# Altium project Mach Master.PrjPCB
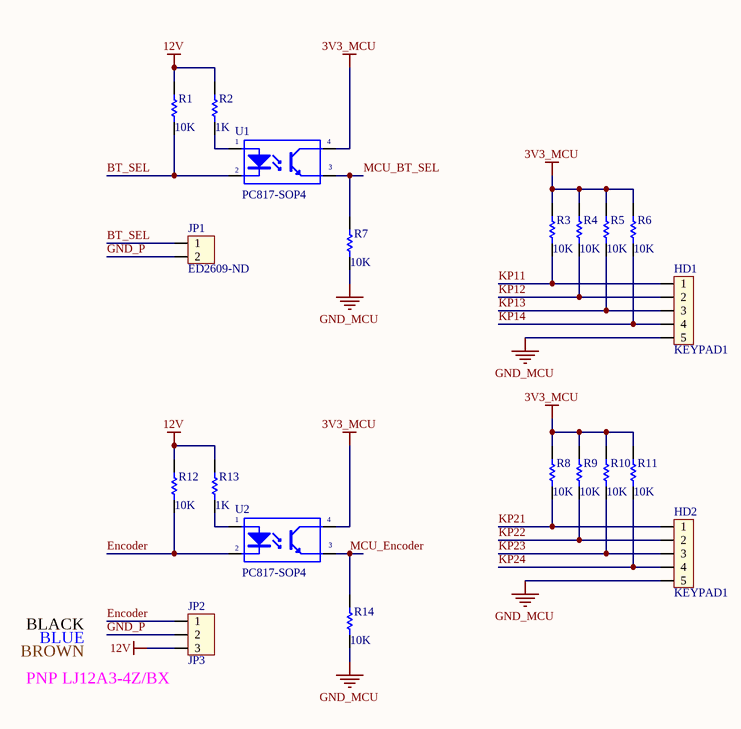
[diagram p0: Input.SchDoc]
5 sheets, 129 parts. Net scope: global (net labels, ports and power ports of the same name join across sheets).
Board file: Master.PcbDoc
Sheets:
  Input.SchDoc
  MCU.SchDoc
  Output.SchDoc
  Power.SchDoc
  RS485.SchDoc

## Sheet Input.SchDoc: INPUT
size A4

### Parts
HD1  KEYPAD1  [CON5]
HD2  KEYPAD1  [CON5]
JP1  ED2609-ND  [2EDGR-5.08-02P]
JP2  JP3  [2EDGR-5.08-03P]
R1  10K  [Res 0805 SMD]
R2  1K  [Res 0805 SMD]
R3  10K  [Res 0805 SMD]
R4  10K  [Res 0805 SMD]
R5  10K  [Res 0805 SMD]
R6  10K  [Res 0805 SMD]
R7  10K  [Res 0805 SMD]
R8  10K  [Res 0805 SMD]
R9  10K  [Res 0805 SMD]
R10  10K  [Res 0805 SMD]
R11  10K  [Res 0805 SMD]
R12  10K  [Res 0805 SMD]
R13  1K  [Res 0805 SMD]
R14  10K  [Res 0805 SMD]
U1  PC817-SOP4  [TPC817-4SOP]
U2  PC817-SOP4  [TPC817-4SOP]

### Nets
3V3_MCU: R3.2 R4.2 R5.2 R6.2 R8.2 R9.2 R10.2 R11.2 U1.4(C) U2.4(C)
12V: JP2.3 R1.2 R2.2 R12.2 R13.2
GND_MCU: HD1.5 HD2.5 R7.1 R14.1
GND_P: JP1.2 JP2.2
BT_SEL: JP1.1 R1.1 U1.2(K)
Encoder: JP2.1 R12.1 U2.2(K)
KP11: HD1.1 R3.1
KP12: HD1.2 R4.1
KP13: HD1.3 R5.1
KP14: HD1.4 R6.1
KP21: HD2.1 R8.1
KP22: HD2.2 R9.1
KP23: HD2.3 R10.1
KP24: HD2.4 R11.1
MCU_BT_SEL: R7.2 U1.3(E)
MCU_Encoder: R14.2 U2.3(E)
NetR2_1: R2.1 U1.1(A)
NetR13_1: R13.1 U2.1(A)

### Notes on the sheet
- BLACK
- BROWN
- (near JP2) PNP LJ12A3-4Z/BX
- BLUE
- Title
- Size:
- Date:
- A4
- Number:
- Time:
- Revision:
- Sheet
- of
- File:

### Library data of the parts
HD1 HD2 = Header5: Header 5; Creat by: VanDungEvn@Gmail.com
JP1 = Con2: 2 Position Wire to Board Terminal Block Horizontal with Board 0.200" (5.08mm) Through Hole; Value: Connector 2; Digikey: ED2609-ND
JP2 = Con3: Connector 3; Value: Connector 3
R1 R12 = 10K/R0603/1%: RES SMD 10K OHM 1% 1/10W 0603; Manufacturer: Yageo; Manufacturer Part Number: RC0603FR-0710KL; Power (Watts): 0.1W, 1/10W; Temperature Coefficient: ±100ppm/°C; Supplier 1: Digi-Key; RoHS: RoHS Compliant; Category: Resistors; Stock 1: 11440000; Pricing 1: 5000=0.00167, 10000=0.00145, 25000=0.00128, 50000=0.00117, 125000=0.00115 (USD); Packaging: Tape & Reel (TR); Resistance (Ohms): 10k; Tolerance: ±1%; Composition: Thick Film; Features: Moisture Resistant; Operating Temperature: -55°C ~ 155°C; Package / Case: 0603 (1608 Metric); Supplier Device Package: 0603; Size / Dimension: 0.063" L x 0.031" W (1.60mm x 0.80mm); Height: 0.022" (0.55mm); Number of Terminations: 2; ComponentLink1URL: http://www.yageo.com/NewPortal/yageodocoutput?fileName=/pdf/R-Chip/PYu-RC_Group_51_RoHS_L_3.pdf; ComponentLink1Description: http://www.yageo.com/NewPortal/yageodocoutput?fileName=/pdf/R-Chip/PYu-RC_Group_51_RoHS_L_3.pdf; Supplier Part Number 1: 311-10.0KHRTR-ND; Buy Link: https://www.thegioiic.com/products?utf8=%E2%9C%93&search=%C4%91i%E1%BB%87n+tr%E1%BB%9F+0805
R2 R13 = 10K/R0603/1%: 1 kOhms ±1% 0.125W, 1/8W Chip Resistor 0805 (2012 Metric) Automotive AEC-Q200 Thick Film; Resistance (Ohms): 10k; Power (Watts): 0.1W, 1/10W; RoHS: RoHS Compliant; Category: Resistors; Features: Moisture Resistant; Operating Temperature: -55°C ~ 155°C; Package / Case: 0603 (1608 Metric); Supplier Device Package: 0603; Size / Dimension: 0.063" L x 0.031" W (1.60mm x 0.80mm); Height: 0.022" (0.55mm); Number of Terminations: 2; ComponentLink1URL: http://www.yageo.com/NewPortal/yageodocoutput?fileName=/pdf/R-Chip/PYu-RC_Group_51_RoHS_L_3.pdf; ComponentLink1Description: http://www.yageo.com/NewPortal/yageodocoutput?fileName=/pdf/R-Chip/PYu-RC_Group_51_RoHS_L_3.pdf; Digikey: 541-1.00KCCT-ND; Buy Link: https://www.thegioiic.com/products?utf8=%E2%9C%93&search=%C4%91i%E1%BB%87n+tr%E1%BB%9F+0805
R3-R11 R14 = 249K/R0805/1%: RES SMD 249K OHM 1% 1/10W 0805; Manufacturer: Yageo; Manufacturer Part Number: RC0603FR-07249KL; Power (Watts): 0.1W, 1/10W; Temperature Coefficient: ±100ppm/°C; Supplier 1: Digi-Key; RoHS: RoHS Compliant; Category: Resistors; Stock 1: 370515; Pricing 1: 1=0.1, 10=0.015, 100=0.006, 1000=0.00268, 2500=0.00233 (USD); Packaging: Cut Tape (CT); Part Status: Active; Tolerance: ±1%; Composition: Thick Film; Features: Moisture Resistant; Operating Temperature: -55°C ~ 155°C; Package / Case: 0603 (1608 Metric); Supplier Device Package: 0603; Size / Dimension: 0.063" L x 0.032" W (1.60mm x 0.80mm); Height - Seated (Max): 0.022" (0.55mm); Failure Rate: -; ComponentLink1URL: http://www.yageo.com/documents/recent/PYu-RC_Group_51_RoHS_L_8.pdf; ComponentLink1Description: http://www.yageo.com/documents/recent/PYu-RC_Group_51_RoHS_L_8.pdf; Buy Link: https://www.thegioiic.com/products?utf8=%E2%9C%93&search=%C4%91i%E1%BB%87n+tr%E1%BB%9F+0805
U1 U2 = PC817: Optoisolator Transistor Output 5000Vrms 1 Channel 4-SOP; Digikey: TPC817S1BRAGCT-ND; BuyVN: https://banlinhkien.vn/goods-1134-pc817-el817-sop4-opto.html

## Sheet MCU.SchDoc: 02 MCU
size A3; Address1: Dệt May Huế; Address2: Nhà máy Sợi; Address3: Xuân Anh - Phước Sơn
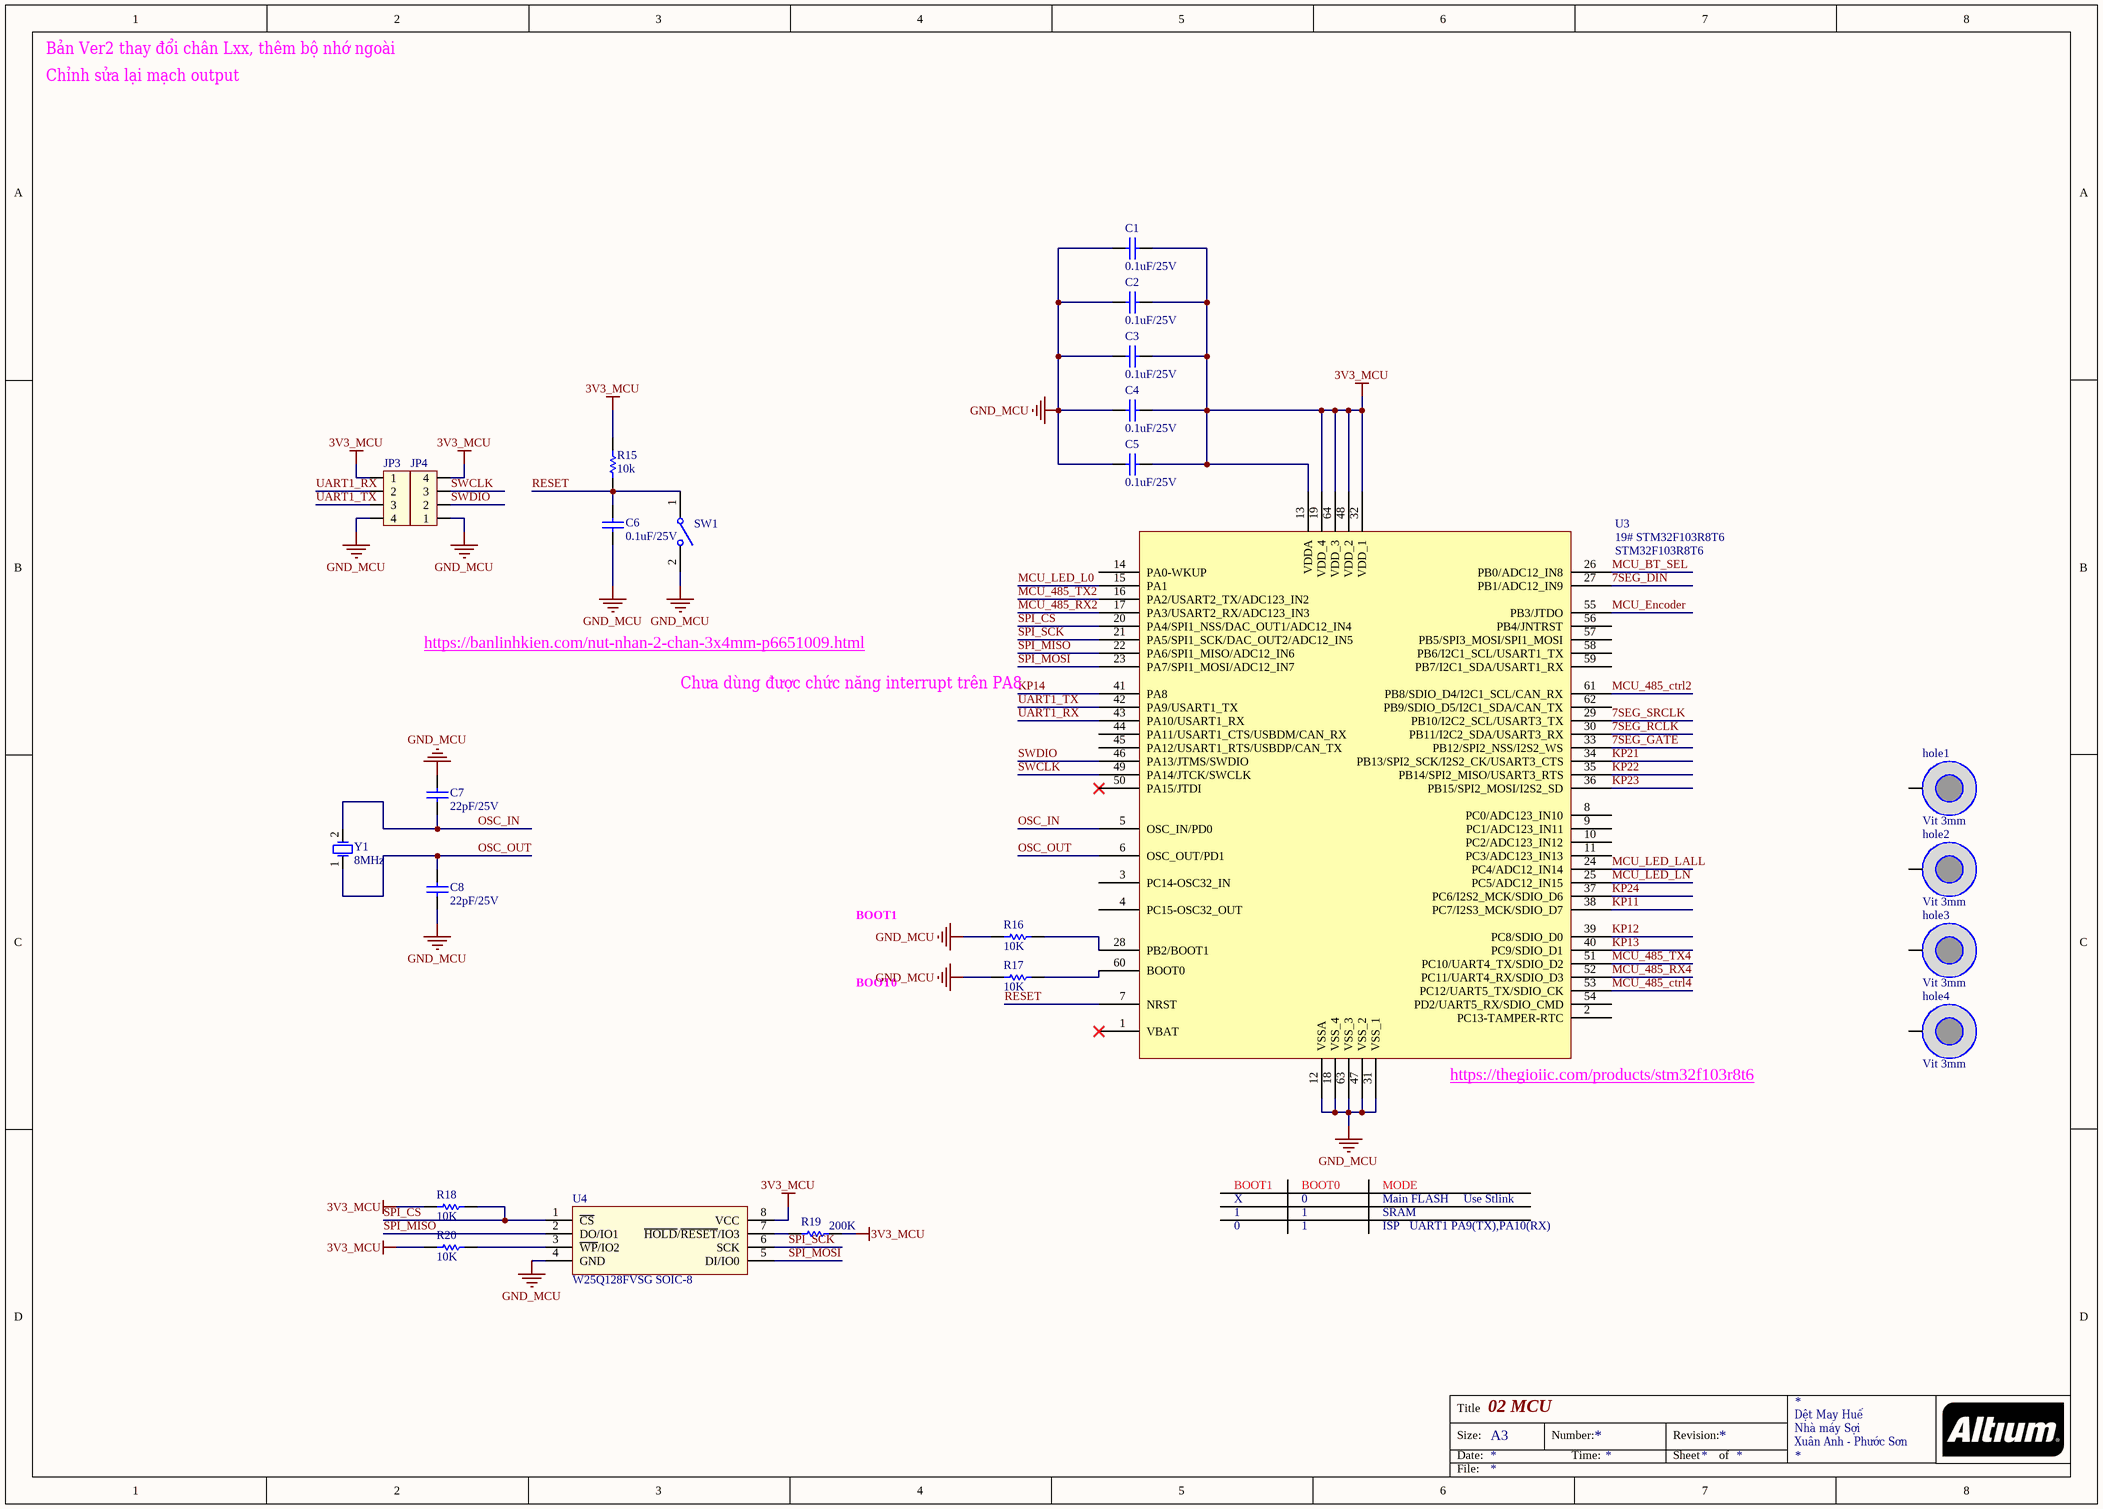
[diagram p1: MCU.SchDoc]

### Parts
C1  0.1uF/25V  [Cap Ceramic 0805 SMD]
C2  0.1uF/25V  [Cap Ceramic 0805 SMD]
C3  0.1uF/25V  [Cap Ceramic 0805 SMD]
C4  0.1uF/25V  [Cap Ceramic 0805 SMD]
C5  0.1uF/25V  [Cap Ceramic 0805 SMD]
C6  0.1uF/25V  [Cap Ceramic 0805 SMD]
C7  22pF/25V  [Cap Ceramic 0805 SMD]
C8  22pF/25V  [Cap Ceramic 0805 SMD]
hole1  Vit 3mm  [Screw 3 small]
hole2  Vit 3mm  [Screw 3 small]
hole3  Vit 3mm  [Screw 3 small]
hole4  Vit 3mm  [Screw 3 small]
JP3  PROGRAM  [Header_4]  (value not drawn)
JP4  PROGRAM  [Header_4]  (value not drawn)
R15  10k  [Res 0805 SMD]
R16  10K  [Res 0805 SMD]
R17  10K  [Res 0805 SMD]
R18  10K  [Res 0805 SMD]
R19  200K  [Res 0805 SMD]
R20  10K  [Res 0805 SMD]
SW1  3x4x2.5 2Pin SMD  [Button 3x4mm]  (value not drawn)
U3  19# STM32F103R8T6  Supplier Part Number 1: STM32F103R8T6  [19# STMF103R8T6]
U4  W25Q128FVSG SOIC-8  [1# W25Q128FV - 8SOIC 5.38mm]
Y1  8MHz  [CRYSTAL SMD]

### Nets
3V3_MCU: C1.2 C2.2 C3.2 C4.2 C5.2 JP3.1 JP4.4 R15.2 R18.2 R19.1 R20.1 U3.13(VDDA) U3.19(VDD_4) U3.32(VDD_1) U3.48(VDD_2) U3.64(VDD_3) U4.8(VCC)
GND_MCU: C1.1 C2.1 C3.1 C4.1 C5.1 C6.1 C7.1 C8.2 JP3.4 JP4.1 R16.2 R17.1 SW1.2(NO1) U3.12(VSSA) U3.18(VSS_4) U3.31(VSS_1) U3.47(VSS_2) U3.63(VSS_3) U4.4(GND)
7SEG_DIN: U3.27(PB1/ADC12_IN9)
7SEG_GATE: U3.33(PB12/SPI2_NSS/I2S2_WS)
7SEG_RCLK: U3.30(PB11/I2C2_SDA/USART3_RX)
7SEG_SRCLK: U3.29(PB10/I2C2_SCL/USART3_TX)
KP11: U3.38(PC7/I2S3_MCK/SDIO_D7)
KP12: U3.39(PC8/SDIO_D0)
KP13: U3.40(PC9/SDIO_D1)
KP14: U3.41(PA8)
KP21: U3.34(PB13/SPI2_SCK/I2S2_CK/USART3_CTS)
KP22: U3.35(PB14/SPI2_MISO/USART3_RTS)
KP23: U3.36(PB15/SPI2_MOSI/I2S2_SD)
KP24: U3.37(PC6/I2S2_MCK/SDIO_D6)
MCU_485_ctrl2: U3.61(PB8/SDIO_D4/I2C1_SCL/CAN_RX)
MCU_485_ctrl4: U3.53(PC12/UART5_TX/SDIO_CK)
MCU_485_RX2: U3.17(PA3/USART2_RX/ADC123_IN3)
MCU_485_RX4: U3.52(PC11/UART4_RX/SDIO_D3)
MCU_485_TX2: U3.16(PA2/USART2_TX/ADC123_IN2)
MCU_485_TX4: U3.51(PC10/UART4_TX/SDIO_D2)
MCU_BT_SEL: U3.26(PB0/ADC12_IN8)
MCU_Encoder: U3.55(PB3/JTDO)
MCU_LED_L0: U3.15(PA1)
MCU_LED_LALL: U3.24(PC4/ADC12_IN14)
MCU_LED_LN: U3.25(PC5/ADC12_IN15)
OSC_IN: C7.2 U3.5(OSC_IN/PD0) Y1.2(OSC2)
OSC_OUT: C8.1 U3.6(OSC_OUT/PD1) Y1.1(OSC1)
RESET: C6.2 R15.1 SW1.1(COMMON1) U3.7(NRST)
SPI_CS: R18.1 U3.20(PA4/SPI1_NSS/DAC_OUT1/ADC12_IN4) U4.1(~{CS})
SPI_MISO: U3.22(PA6/SPI1_MISO/ADC12_IN6) U4.2(DO/IO1)
SPI_MOSI: U3.23(PA7/SPI1_MOSI/ADC12_IN7) U4.5(DI/IO0)
SPI_SCK: U3.21(PA5/SPI1_SCK/DAC_OUT2/ADC12_IN5) U4.6(SCK)
SWCLK: JP4.3 U3.49(PA14/JTCK/SWCLK)
SWDIO: JP4.2 U3.46(PA13/JTMS/SWDIO)
UART1_RX: JP3.2 U3.43(PA10/USART1_RX)
UART1_TX: JP3.3 U3.42(PA9/USART1_TX)
NetR16_1: R16.1 U3.28(PB2/BOOT1)
NetR17_2: R17.2 U3.60(BOOT0)
NetR19_2: R19.2 U4.7(~{HOLD}/~{RESET}/IO3)
NetR20_2: R20.2 U4.3(~{WP}/IO2)

Not connected (* = marked no-connect by the designer): hole1 1(hole); hole2 1(hole); hole3 1(hole); hole4 1(hole); U3 1(VBAT)* 2(PC13-TAMPER-RTC) 3(PC14-OSC32_IN) 4(PC15-OSC32_OUT) 8(PC0/ADC123_IN10) 9(PC1/ADC123_IN11) 10(PC2/ADC123_IN12) 11(PC3/ADC123_IN13) 14(PA0-WKUP) 44(PA11/USART1_CTS/USBDM/CAN_RX) 45(PA12/USART1_RTS/USBDP/CAN_TX) 50(PA15/JTDI)* 54(PD2/UART5_RX/SDIO_CMD) 56(PB4/JNTRST) 57(PB5/SPI3_MOSI/SPI1_MOSI) 58(PB6/I2C1_SCL/USART1_TX) 59(PB7/I2C1_SDA/USART1_RX) 62(PB9/SDIO_D5/I2C1_SDA/CAN_TX)

### Notes on the sheet
- Bản Ver2 thay đổi chân Lxx, thêm bộ nhớ ngoài
- Chỉnh sửa lại mạch output
- https://banlinhkien.com/nut-nhan-2-chan-3x4mm-p6651009.html
- Chưa dùng được chức năng interrupt trên PA8
- BOOT1
- BOOT0
- (near U3) https://thegioiic.com/products/stm32f103r8t6
- MODE
- X
- 1
- 0
- Main FLASH
- SRAM
- ISP
- UART1 PA9(TX),PA10(RX)
- Use Stlink
- Title
- Size:
- Date:
- A3
- Number:
- Time:
- Revision:
- Sheet
- of
- File:

### Library data of the parts
C1-C6 = 0.1uF/25V/C0603/10%: CAP CER 0.1UF 25V 10% X7R 0603; Manufacturer: Murata Electronics North America; Manufacturer Part Number: GRM188R71E104KA01D; Capacitance: 0.1µF; RoHS: RoHS Compliant; Category: Capacitors; Packaging: Cut Tape (CT); Tolerance: ±10%; Voltage - Rated: 25V; Temperature Coefficient: X7R; Mounting Type: Surface Mount, MLCC; Operating Temperature: -55°C ~ 125°C; Applications: General Purpose; Ratings: -; Package / Case: 0603 (1608 Metric); Size / Dimension: 0.063" L x 0.031" W (1.60mm x 0.80mm); Height - Seated (Max): -; Thickness (Max): 0.035" (0.90mm); Lead Spacing: -; Features: -; Lead Style: -; ComponentLink1URL: http://www.murata.com/~/media/webrenewal/support/library/catalog/products/capacitor/mlcc/c02e.ashx; ComponentLink1Description: http://www.murata.com/~/media/webrenewal/support/library/catalog/products/capacitor/mlcc/c02e.ashx; Supplier 1: Digi-Key; Supplier Part Number 1: 490-1524-1-ND
C7 C8 = 22pF/50V/C0603/10%: CAP CER 22PF 50V NP0 0603; Manufacturer: Kemet; Manufacturer Part Number: C0603C220K5GACTU; Tolerance: ±10%; Temperature Coefficient: C0G, NP0; RoHS: RoHS Compliant; Category: Capacitors; Packaging: Digi-Reel®; Capacitance: 22pF; Voltage - Rated: 50V; Mounting Type: Surface Mount, MLCC; Operating Temperature: -55°C ~ 125°C; Applications: General Purpose; Ratings: -; Package / Case: 0603 (1608 Metric); Size / Dimension: 0.063" L x 0.031" W (1.60mm x 0.80mm); Height - Seated (Max): -; Thickness (Max): 0.034" (0.87mm); Lead Spacing: -; Features: -; Lead Style: -; ComponentLink1URL: http://www.kemet.com/docfinder?Partnumber=C0603C220K5GACTU; ComponentLink1Description: http://www.kemet.com/docfinder?Partnumber=C0603C220K5GACTU; Supplier 1: Digi-Key; Supplier Part Number 1: 399-7875-1-ND
JP3 JP4 = Con4: Connector 4; Value: Connector 4
R15-R18 R20 = 10K/R0603/1%: as R1 on sheet Input; Supplier 1: Digi-Key; RoHS: RoHS Compliant; Category: Resistors; Stock 1: 11440000; Pricing 1: 5000=0.00167, 10000=0.00145, 25000=0.00128, 50000=0.00117, 125000=0.00115 (USD); Packaging: Tape & Reel (TR); Resistance (Ohms): 10k; Tolerance: ±1%; Composition: Thick Film; Features: Moisture Resistant; Operating Temperature: -55°C ~ 155°C; Package / Case: 0603 (1608 Metric); Supplier Device Package: 0603; Size / Dimension: 0.063" L x 0.031" W (1.60mm x 0.80mm); Height: 0.022" (0.55mm); Number of Terminations: 2; ComponentLink1URL: http://www.yageo.com/NewPortal/yageodocoutput?fileName=/pdf/R-Chip/PYu-RC_Group_51_RoHS_L_3.pdf; ComponentLink1Description: http://www.yageo.com/NewPortal/yageodocoutput?fileName=/pdf/R-Chip/PYu-RC_Group_51_RoHS_L_3.pdf; Supplier Part Number 1: 311-10.0KHRTR-ND
  R15-R17: Buy Link: https://www.thegioiic.com/products?utf8=%E2%9C%93&search=%C4%91i%E1%BB%87n+tr%E1%BB%9F+0805
R19 = 200K/R0603/1%: RES SMD 200K OHM 1% 1/10W 0603; Manufacturer: Yageo; Manufacturer Part Number: RC0603FR-07200KL; Power (Watts): 0.1W, 1/10W; Temperature Coefficient: ±100ppm/°C; Supplier 1: Digi-Key; RoHS: RoHS Compliant; Category: Resistors; Stock 1: 924437; Pricing 1: 1=0.1, 10=0.015, 100=0.006, 1000=0.00268, 2500=0.00233 (USD); Packaging: Cut Tape (CT); Part Status: Active; Tolerance: ±1%; Composition: Thick Film; Features: Moisture Resistant; Operating Temperature: -55°C ~ 155°C; Package / Case: 0603 (1608 Metric); Supplier Device Package: 0603; Size / Dimension: 0.063" L x 0.031" W (1.60mm x 0.80mm); Height - Seated (Max): 0.022" (0.55mm); Failure Rate: -; ComponentLink1URL: http://www.yageo.com/documents/recent/PYu-RC_Group_51_RoHS_L_7.pdf; ComponentLink1Description: http://www.yageo.com/documents/recent/PYu-RC_Group_51_RoHS_L_7.pdf; Supplier Part Number 1: 311-200KHRCT-ND
SW1 = BUTTON 2-SMD RS-282G05A3: Manufacturer: C&K Components; Manufacturer Part Number: RS-282G05A3-SM RT; Circuit: SPST-NO; Switch Function: Off-Mom; Contact Rating @ Voltage: 0.05A @ 12VDC; Actuator Type: Rectangular Button; Actuator Height off PCB, from Pins: 2.50mm; Actuator Orientation: Top Actuated; Outline: 6.00mm x 3.60mm; Illumination: Non-Illuminated; Operating Force: 250gf; Actuator Material: Polyamide (PA), Nylon; Switch Travel: 0.25mm; Mechanical Life: 50,000 Cycles; RoHS: RoHS Compliant; Category: Switches; Packaging: Cut Tape (CT); Part Status: Active; Mounting Type: Surface Mount; Termination Style: Gull Wing; Illumination Voltage (Nominal): -; Illumination Type, Color: -; Ingress Protection: -; Features: -; Operating Temperature: -; ComponentLink1URL: http://media.digikey.com/pdf/Data%20Sheets/C&K/RS-282G05A-SM_RT.pdf; ComponentLink1Description: http://media.digikey.com/pdf/Data%20Sheets/C&K/RS-282G05A-SM_RT.pdf; Supplier 1: Digi-Key; Supplier Part Number 1: CKN10384CT-ND; Buy Link: https://thegioiic.com/products/nut-nhan-3x4x2-5-2pin-smd
U3 = 19# STM32F103R8T6: STM32 ARM-based 32-bit MCU with ARM 32-bit Cortex-M3 Microcontroller, 64 Kbytes Flash, 64-pin LQFP, Industrial Temperature; UART: 5; I2C: 2; SPI/I2S: 3; USB 2.0: 1; ARM Core: Cortex M3; Published: 30-May-2008; DatasheetVersion: rev6, Mar-2008; PackageVersion: Mar-2008; PackageReference: LQFP64; Publisher: Altium Limited; PackageDescription: 64-Pin Low-Profile Quad Flat Pack, 10 x 10 mm Body, 0.5 mm Pitch (LQFP64); ComponentLink1Description: Manufacturer Link; ComponentLink1URL: www.st.com/stm32; ComponentLink2Description: Datasheet; ComponentLink2URL: http://www.st.com/stonline/products/literature/ds/13587.pdf; CAN 2.0: 1; ADC: 3; DAC: 2; Case/Package: LQFP - 64; Supplier 1: Future Electronics; Buy Link: https://thegioiic.com/products/stm32f103r8t6
U4 = 1# W25Q128FVSG SOIC-8
Y1 = Crystal SMD FA-128 26MHz: 8MHz SMD; Value: 26MHz; ComponentLink1Description: Datasheet; ComponentLink1URL: D:\Dropbox\Datasheets\Passive Components\Crystals\HC49S.pdf; Unit Price: 0.0440

## Sheet Output.SchDoc: OUTPUT
size A4
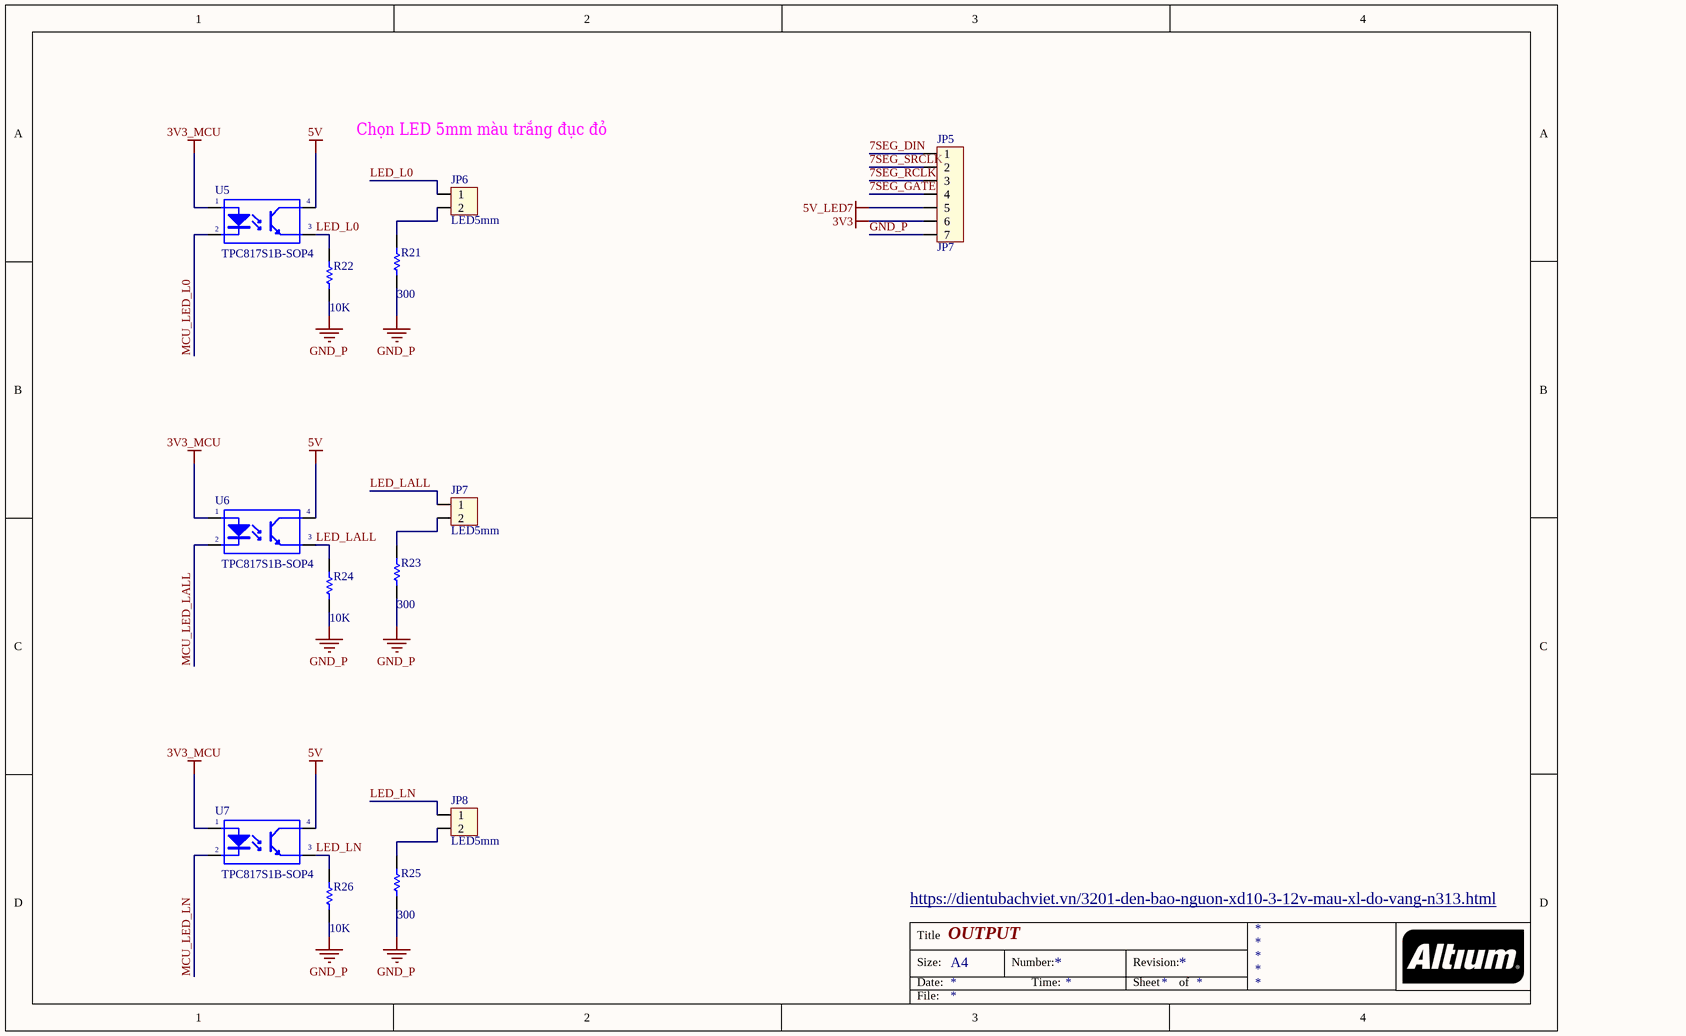
[diagram p2: Output.SchDoc]

### Parts
JP5  JP7  [CON7]
JP6  LED5mm  [CON2]
JP7  LED5mm  [CON2]
JP8  LED5mm  [CON2]
R21  300  [Res 0805 SMD]
R22  10K  [Res 0805 SMD]
R23  300  [Res 0805 SMD]
R24  10K  [Res 0805 SMD]
R25  300  [Res 0805 SMD]
R26  10K  [Res 0805 SMD]
U5  TPC817S1B-SOP4  [TPC817-4SOP]
U6  TPC817S1B-SOP4  [TPC817-4SOP]
U7  TPC817S1B-SOP4  [TPC817-4SOP]

### Nets
3V3: JP5.6
3V3_MCU: U5.1(A) U6.1(A) U7.1(A)
5V: U5.4(C) U6.4(C) U7.4(C)
5V_LED7: JP5.5
GND_P: JP5.7 R21.1 R22.1 R23.1 R24.1 R25.1 R26.1
7SEG_DIN: JP5.1
7SEG_GATE: JP5.4
7SEG_RCLK: JP5.3
7SEG_SRCLK: JP5.2
LED_L0: JP6.1 R22.2 U5.3(E)
LED_LALL: JP7.1 R24.2 U6.3(E)
LED_LN: JP8.1 R26.2 U7.3(E)
MCU_LED_L0: U5.2(K)
MCU_LED_LALL: U6.2(K)
MCU_LED_LN: U7.2(K)
NetJP6_2: JP6.2 R21.2
NetJP7_2: JP7.2 R23.2
NetJP8_2: JP8.2 R25.2

### Notes on the sheet
- Chọn LED 5mm màu trắng đục đỏ
- https://dientubachviet.vn/3201-den-bao-nguon-xd10-3-12v-mau-xl-do-vang-n313.html
- Title
- Size:
- Date:
- A4
- Number:
- Time:
- Revision:
- Sheet
- of
- File:

### Library data of the parts
JP5 = Con7: Connector 7; Value: Connector 7
JP6-JP8 = Con2: Connector 2; Value: Connector 2
R21-R26 = 249K/R0805/1%: as R3 on sheet Input; Supplier 1: Digi-Key; RoHS: RoHS Compliant; Category: Resistors; Stock 1: 370515; Pricing 1: 1=0.1, 10=0.015, 100=0.006, 1000=0.00268, 2500=0.00233 (USD); Packaging: Cut Tape (CT); Part Status: Active; Tolerance: ±1%; Composition: Thick Film; Features: Moisture Resistant; Operating Temperature: -55°C ~ 155°C; Package / Case: 0603 (1608 Metric); Supplier Device Package: 0603; Size / Dimension: 0.063" L x 0.032" W (1.60mm x 0.80mm); Height - Seated (Max): 0.022" (0.55mm); Failure Rate: -; ComponentLink1URL: http://www.yageo.com/documents/recent/PYu-RC_Group_51_RoHS_L_8.pdf; ComponentLink1Description: http://www.yageo.com/documents/recent/PYu-RC_Group_51_RoHS_L_8.pdf
U5-U7 = PC817: as U1 on sheet Input; Digikey: TPC817S1BRAGCT-ND

## Sheet Power.SchDoc: Power
size A4
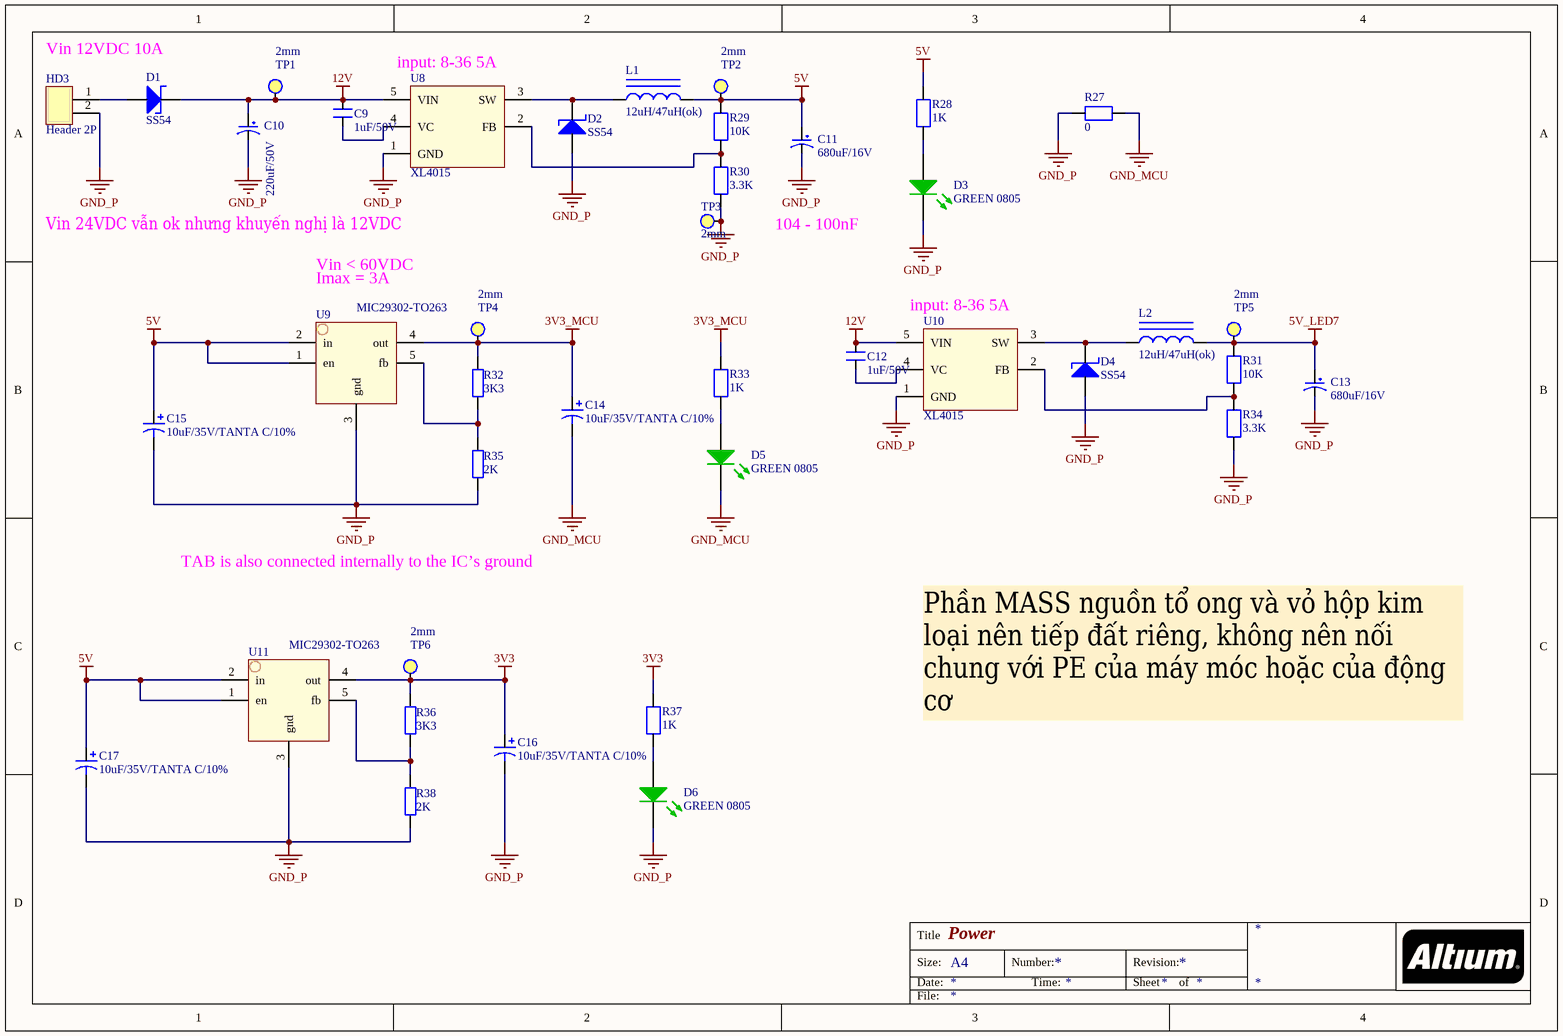
[diagram p3: Power.SchDoc]

### Parts
C9  1uF/50V  [Cap Ceramic 0805 SMD]
C10  220uF/50V  [CAP ALU CASE G SMD]
C11  680uF/16V  [CAP ALU CASE G SMD]
C12  1uF/50V  [Cap Ceramic 0805 SMD]
C13  680uF/16V  [CAP ALU CASE G SMD]
C14  10uF/35V/TANTA C/10%  [CAP TANT CASE C SMD]
C15  10uF/35V/TANTA C/10%  [CAP TANT CASE C SMD]
C16  10uF/35V/TANTA C/10%  [CAP TANT CASE C SMD]
C17  10uF/35V/TANTA C/10%  [CAP TANT CASE C SMD]
D1  SS54  [DO-214AB/SMC]
D2  SS54  [DO-214AB/SMC]
D3  GREEN 0805  [Led 0805G]
D4  SS54  [DO-214AB/SMC]
D5  GREEN 0805  [Led 0805G]
D6  GREEN 0805  [Led 0805G]
HD3  Header 2P  [2EDGR-5.08-02P]
L1  12uH/47uH(ok)  [POWER INDUCTOR]
L2  12uH/47uH(ok)  [POWER INDUCTOR]
R27  0  [Res 0805 SMD]
R28  1K  [Res 0805 SMD]
R29  10K  [Res 0805 SMD]
R30  3.3K  [Res 0805 SMD]
R31  10K  [Res 0805 SMD]
R32  3K3  [Res 0805 SMD]
R33  1K  [Res 0805 SMD]
R34  3.3K  [Res 0805 SMD]
R35  2K  [Res 0805 SMD]
R36  3K3  [Res 0805 SMD]
R37  1K  [Res 0805 SMD]
R38  2K  [Res 0805 SMD]
TP1  2mm  [Test Point 2mm]
TP2  2mm  [Test Point 2mm]
TP3  2mm  [Test Point 2mm]
TP4  2mm  [Test Point 2mm]
TP5  2mm  [Test Point 2mm]
TP6  2mm  [Test Point 2mm]
U8  XL4015  [TO-263-5P]
U9  MIC29302-TO263  [MIC29302-TO263]
U10  XL4015  [TO-263-5P]
U11  MIC29302-TO263  [MIC29302-TO263]

### Nets
3V3: C16.1 R36.2 R37.2 TP6.1 U11.4(out)
3V3_MCU: C14.1 R32.2 R33.2 TP4.1 U9.4(out)
5V: C11.1 C15.1 C17.1 L1.2 R28.2 R29.2 TP2.1 U9.1(en) U9.2(in) U11.1(en) U11.2(in)
5V_LED7: C13.1 L2.2 R31.2 TP5.1
12V: C9.1 C10.1 C12.1 D1.2(K) TP1.1 U8.5(VIN) U10.5(VIN)
GND_MCU: C14.2 D5.2(K) R27.1
GND_P: C10.2 C11.2 C13.2 C15.2 C16.2 C17.2 D2.1(A) D3.2(K) D4.1(A) D6.2(K) HD3.2 R27.2 R30.1 R34.1 R35.1 R38.1 TP3.1 U8.1(GND) U9.3(gnd) U10.1(GND) U11.3(gnd)
NetC9_2: C9.2 U8.4(VC)
NetC12_2: C12.2 U10.4(VC)
NetD1_1: D1.1(A) HD3.1
NetD2_2: D2.2(K) L1.1 U8.3(SW)
NetD3_1: D3.1(A) R28.1
NetD4_2: D4.2(K) L2.1 U10.3(SW)
NetD5_1: D5.1(A) R33.1
NetD6_1: D6.1(A) R37.1
NetR29_1: R29.1 R30.2 U8.2(FB)
NetR31_1: R31.1 R34.2 U10.2(FB)
NetR32_1: R32.1 R35.2 U9.5(fb)
NetR36_1: R36.1 R38.2 U11.5(fb)

### Notes on the sheet
- Vin 12VDC 10A
- (near U8) input: 8-36 5A
- Vin 24VDC vẫn ok nhưng khuyến nghị là 12VDC
- 104 - 100nF
- Vin < 60VDC
- Imax = 3A
- (near U10) input: 8-36 5A
- TAB is also connected internally to the IC’s ground
- Phần MASS nguồn tổ ong và vỏ hộp kim loại nên tiếp đất riêng, không nên nối chung với PE của máy móc hoặc của động cơ
- Title
- Size:
- Date:
- A4
- Number:
- Time:
- Revision:
- Sheet
- of
- File:

### Library data of the parts
C9 C12 = Cap Ceramic SMD: Buy Link: https://www.thegioiic.com/products/tu-1uf-50v-0805
C10 C11 C13 = Cap Alu SMD
  C10: Buy Link: https://www.thegioiic.com/products/tu-nhom-smd-220uf-50v-d10l10
C14-C17 = TAJB106M025RNJ: Tantalum Capacitors - Solid SMD 25v 10uF 20%Tol Code C; Manufacturer: Kyocera AVX; Tolerance: 20%; ESR (Equivalent Series Resistance): 2.5R; Leakage Current: 2.5uA; Polarity: Polar; Dissipation Factor: 6%; Supplier 1: Digi-Key; Manufacturer Part Number: TAJB106M025RNJ; Stock 1: 10615; Pricing 1: 1=0.74, 10=0.524, 100=0.3453, 500=0.2558, 1000=0.2174 (USD); Mount: Surface Mount; Case/Package: 1210; Weight: 0.000564oz; Case Code (Metric): 3528; Case Code (Imperial): 1210; Min Operating Temperature: -55°C; Max Operating Temperature: 125°C; Packaging: Tape and Reel; Capacitance: 10uF; Voltage Rating: 25V; Package Quantity: 2000; Termination: SMD/SMT; Voltage Rating (DC): 25V; Features: General Purpose; Length: 3.5mm; Height: 2.1mm; Width: 0.11inch; Height - Seated (Max): 0.083inch; Depth: 2.8mm; Lead Free: Lead Free; Supplier Part Number 1: 478-8887-1-ND; Buy Link: https://banlinhkien.com/tu-tantalum-106v10uf-35v-smd6032-p6650491.html
D1 D2 D4 = Diode Schottky
  D2 D4: Buy Link: https://www.thegioiic.com/products/ss54-smc
D3 D5 D6 = LED GREEN 0603: LED GREEN CLEAR 0603 SMD; Manufacturer: Lite-On Inc.; Manufacturer Part Number: LTST-C190KGKT; Lens Color: Colorless; Millicandela Rating: 35mcd; Lens Style/Size: Rectangle with Flat Top, 1.10mm x 0.80mm; Voltage - Forward (Vf) (Typ): 2V; Current - Test: 20mA; Viewing Angle: 130°; Wavelength - Dominant: 571nm; Wavelength - Peak: 574nm; RoHS: RoHS Compliant; Category: Optoelectronics; Packaging: Cut Tape (CT); Color: Green; Lens Transparency: Clear; Mounting Type: Surface Mount; Features: -; Package / Case: 0603 (1608 Metric); Supplier Device Package: *; Size / Dimension: 1.60mm L x 0.80mm W; Height (Max): 0.80mm; ComponentLink1URL: http://optoelectronics.liteon.com/upload/download/DS22-2000-074/S_110_LTST-C190KGKT.pdf; ComponentLink1Description: http://optoelectronics.liteon.com/upload/download/DS22-2000-074/S_110_LTST-C190KGKT.pdf; Supplier 1: Digi-Key; Supplier Part Number 1: 160-1435-1-ND; Buy Link: https://www.thegioiic.com/products/led-do-0805
L1 L2 = Power Inductor: CDRH127; Buy Link: https://www.thegioiic.com/products/cuon-cam-12uh-rh127-smd-12x12x7
R27-R31 R33 R34 R37 = Resistor: Buy Link: https://www.thegioiic.com/products?utf8=%E2%9C%93&search=%C4%91i%E1%BB%87n+tr%E1%BB%9F+0805
R32 R35 R36 R38 = R0805: Resistor SMD 0805; Published: 8-Jun-2000; LatestRevisionDate: 17-Jul-2002; LatestRevisionNote: Re-released for DXP Platform.; PackageReference: AXIAL-0.4; Publisher: Altium Limited
TP1-TP6 = Test Point: Test Point SMD
U8 U10 = XL4015: TO-263 5P; Buy Link: https://thegioiic.com/products/xl4015
U9 U11 = MIC29302: MIC29302 TO263 / High-Current Low-Dropout Regulators; Buy Link: https://thegioiic.com/products/mic29302

## Sheet RS485.SchDoc: RS485
size A4
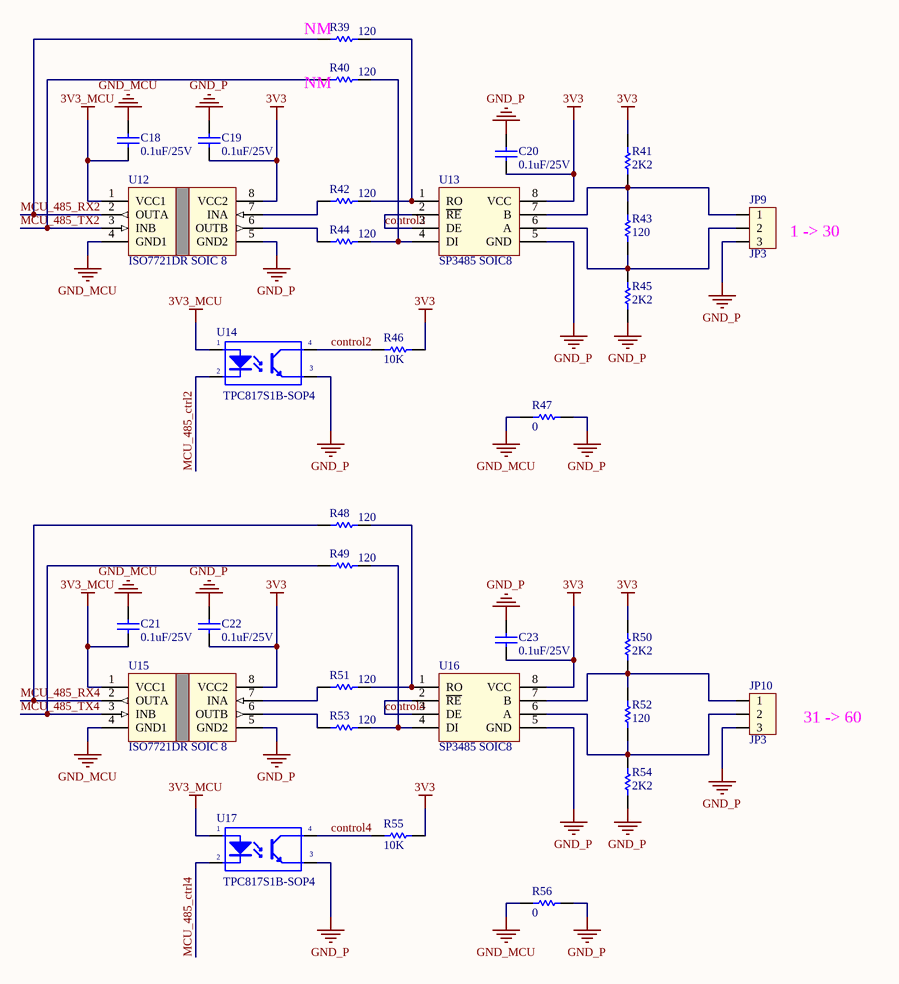
[diagram p4: RS485.SchDoc]

### Parts
C18  0.1uF/25V  [Cap Ceramic 0805 SMD]
C19  0.1uF/25V  [Cap Ceramic 0805 SMD]
C20  0.1uF/25V  [Cap Ceramic 0805 SMD]
C21  0.1uF/25V  [Cap Ceramic 0805 SMD]
C22  0.1uF/25V  [Cap Ceramic 0805 SMD]
C23  0.1uF/25V  [Cap Ceramic 0805 SMD]
JP9  JP3  [2EDGR-5.08-03P]
JP10  JP3  [2EDGR-5.08-03P]
R39  120  [Res 0805 SMD]
R40  120  [Res 0805 SMD]
R41  2K2  [Res 0805 SMD]
R42  120  [Res 0805 SMD]
R43  120  [Res 0805 SMD]
R44  120  [Res 0805 SMD]
R45  2K2  [Res 0805 SMD]
R46  10K  [Res 0805 SMD]
R47  0  [Res 0805 SMD]
R48  120  [Res 0805 SMD]
R49  120  [Res 0805 SMD]
R50  2K2  [Res 0805 SMD]
R51  120  [Res 0805 SMD]
R52  120  [Res 0805 SMD]
R53  120  [Res 0805 SMD]
R54  2K2  [Res 0805 SMD]
R55  10K  [Res 0805 SMD]
R56  0  [Res 0805 SMD]
U12  ISO7721DR SOIC 8  [ISO7721D SOIC-8 10.9mm]
U13  SP3485 SOIC8  [SP3485 SOIC-8 3.9mm]
U14  TPC817S1B-SOP4  [TPC817-4SOP]
U15  ISO7721DR SOIC 8  [ISO7721D SOIC-8 10.9mm]
U16  SP3485 SOIC8  [SP3485 SOIC-8 3.9mm]
U17  TPC817S1B-SOP4  [TPC817-4SOP]

### Nets
3V3: C19.1 C20.1 C22.1 C23.1 R41.2 R46.1 R50.2 R55.1 U12.8(VCC2) U13.8(VCC) U15.8(VCC2) U16.8(VCC)
3V3_MCU: C18.1 C21.1 U12.1(VCC1) U14.1(A) U15.1(VCC1) U17.1(A)
GND_MCU: C18.2 C21.2 R47.2 R56.2 U12.4(GND1) U15.4(GND1)
GND_P: C19.2 C20.2 C22.2 C23.2 JP9.3 JP10.3 R45.1 R47.1 R54.1 R56.1 U12.5(GND2) U13.5(GND) U14.3(E) U15.5(GND2) U16.5(GND) U17.3(E)
control2: R46.2 U13.2(~{RE}) U13.3(DE) U14.4(C)
control4: R55.2 U16.2(~{RE}) U16.3(DE) U17.4(C)
MCU_485_ctrl2: U14.2(K)
MCU_485_ctrl4: U17.2(K)
MCU_485_RX2: R39.1 U12.2(OUTA)
MCU_485_RX4: R48.1 U15.2(OUTA)
MCU_485_TX2: R40.1 U12.3(INB)
MCU_485_TX4: R49.1 U15.3(INB)
NetJP9_1: JP9.1 R41.1 R43.2 U13.7(B)
NetJP9_2: JP9.2 R43.1 R45.2 U13.6(A)
NetJP10_1: JP10.1 R50.1 R52.2 U16.7(B)
NetJP10_2: JP10.2 R52.1 R54.2 U16.6(A)
NetR39_2: R39.2 R42.2 U13.1(RO)
NetR40_2: R40.2 R44.2 U13.4(DI)
NetR42_1: R42.1 U12.7(INA)
NetR44_1: R44.1 U12.6(OUTB)
NetR48_2: R48.2 R51.2 U16.1(RO)
NetR49_2: R49.2 R53.2 U16.4(DI)
NetR51_1: R51.1 U15.7(INA)
NetR53_1: R53.1 U15.6(OUTB)

### Notes on the sheet
- (near R39) NM
- (near R40) NM
- (near JP9) 1 -> 30
- 31 -> 60
- Title
- Size:
- Date:
- A4
- Number:
- Time:
- Revision:
- Sheet
- of
- File:

### Library data of the parts
C18-C23 = 0.1uF/25V/C0603/10%: as C1 on sheet MCU; RoHS: RoHS Compliant; Category: Capacitors; Packaging: Cut Tape (CT); Tolerance: ±10%; Voltage - Rated: 25V; Temperature Coefficient: X7R; Mounting Type: Surface Mount, MLCC; Operating Temperature: -55°C ~ 125°C; Applications: General Purpose; Ratings: -; Package / Case: 0603 (1608 Metric); Size / Dimension: 0.063" L x 0.031" W (1.60mm x 0.80mm); Height - Seated (Max): -; Thickness (Max): 0.035" (0.90mm); Lead Spacing: -; Features: -; Lead Style: -; ComponentLink1URL: http://www.murata.com/~/media/webrenewal/support/library/catalog/products/capacitor/mlcc/c02e.ashx; ComponentLink1Description: http://www.murata.com/~/media/webrenewal/support/library/catalog/products/capacitor/mlcc/c02e.ashx; Supplier 1: Digi-Key; Supplier Part Number 1: 490-1524-1-ND
JP9 JP10 = Con3: Connector 3; Value: Connector 3
R39-R56 = 249K/R0805/1%: as R3 on sheet Input; Supplier 1: Digi-Key; RoHS: RoHS Compliant; Category: Resistors; Stock 1: 370515; Pricing 1: 1=0.1, 10=0.015, 100=0.006, 1000=0.00268, 2500=0.00233 (USD); Packaging: Cut Tape (CT); Part Status: Active; Tolerance: ±1%; Composition: Thick Film; Features: Moisture Resistant; Operating Temperature: -55°C ~ 155°C; Package / Case: 0603 (1608 Metric); Supplier Device Package: 0603; Size / Dimension: 0.063" L x 0.032" W (1.60mm x 0.80mm); Height - Seated (Max): 0.022" (0.55mm); Failure Rate: -; ComponentLink1URL: http://www.yageo.com/documents/recent/PYu-RC_Group_51_RoHS_L_8.pdf; ComponentLink1Description: http://www.yageo.com/documents/recent/PYu-RC_Group_51_RoHS_L_8.pdf
U12 U15 = ISO7721DR SOIC 8: ISO772x High-Speed, Robust EMC, Reinforced Dual-Channel Digital Isolators
U14 U17 = PC817: as U1 on sheet Input; Digikey: TPC817S1BRAGCT-ND

## Nets that join several sheets
3V3: Output (JP5.6), Power (5 pins), RS485 (12 pins)
3V3_MCU: Input (10 pins), MCU (17 pins), Output (U5.1 U6.1 U7.1), Power (5 pins), RS485 (6 pins)
5V: Output (U5.4 U6.4 U7.4), Power (11 pins)
5V_LED7: Output (JP5.5), Power (C13.1 L2.2 R31.2 TP5.1)
12V: Input (5 pins), Power (7 pins)
GND_MCU: Input (HD1.5 HD2.5 R7.1 R14.1), MCU (19 pins), Power (C14.2 D5.2 R27.1), RS485 (6 pins)
GND_P: Input (JP1.2 JP2.2), Output (7 pins), Power (21 pins), RS485 (16 pins)
7SEG_DIN: MCU (U3.27), Output (JP5.1)
7SEG_GATE: MCU (U3.33), Output (JP5.4)
7SEG_RCLK: MCU (U3.30), Output (JP5.3)
7SEG_SRCLK: MCU (U3.29), Output (JP5.2)
KP11: Input (HD1.1 R3.1), MCU (U3.38)
KP12: Input (HD1.2 R4.1), MCU (U3.39)
KP13: Input (HD1.3 R5.1), MCU (U3.40)
KP14: Input (HD1.4 R6.1), MCU (U3.41)
KP21: Input (HD2.1 R8.1), MCU (U3.34)
KP22: Input (HD2.2 R9.1), MCU (U3.35)
KP23: Input (HD2.3 R10.1), MCU (U3.36)
KP24: Input (HD2.4 R11.1), MCU (U3.37)
MCU_485_ctrl2: MCU (U3.61), RS485 (U14.2)
MCU_485_ctrl4: MCU (U3.53), RS485 (U17.2)
MCU_485_RX2: MCU (U3.17), RS485 (R39.1 U12.2)
MCU_485_RX4: MCU (U3.52), RS485 (R48.1 U15.2)
MCU_485_TX2: MCU (U3.16), RS485 (R40.1 U12.3)
MCU_485_TX4: MCU (U3.51), RS485 (R49.1 U15.3)
MCU_BT_SEL: Input (R7.2 U1.3), MCU (U3.26)
MCU_Encoder: Input (R14.2 U2.3), MCU (U3.55)
MCU_LED_L0: MCU (U3.15), Output (U5.2)
MCU_LED_LALL: MCU (U3.24), Output (U6.2)
MCU_LED_LN: MCU (U3.25), Output (U7.2)